# EAGLE design cpx-synth1-pcb (EAGLE 8.6.3)
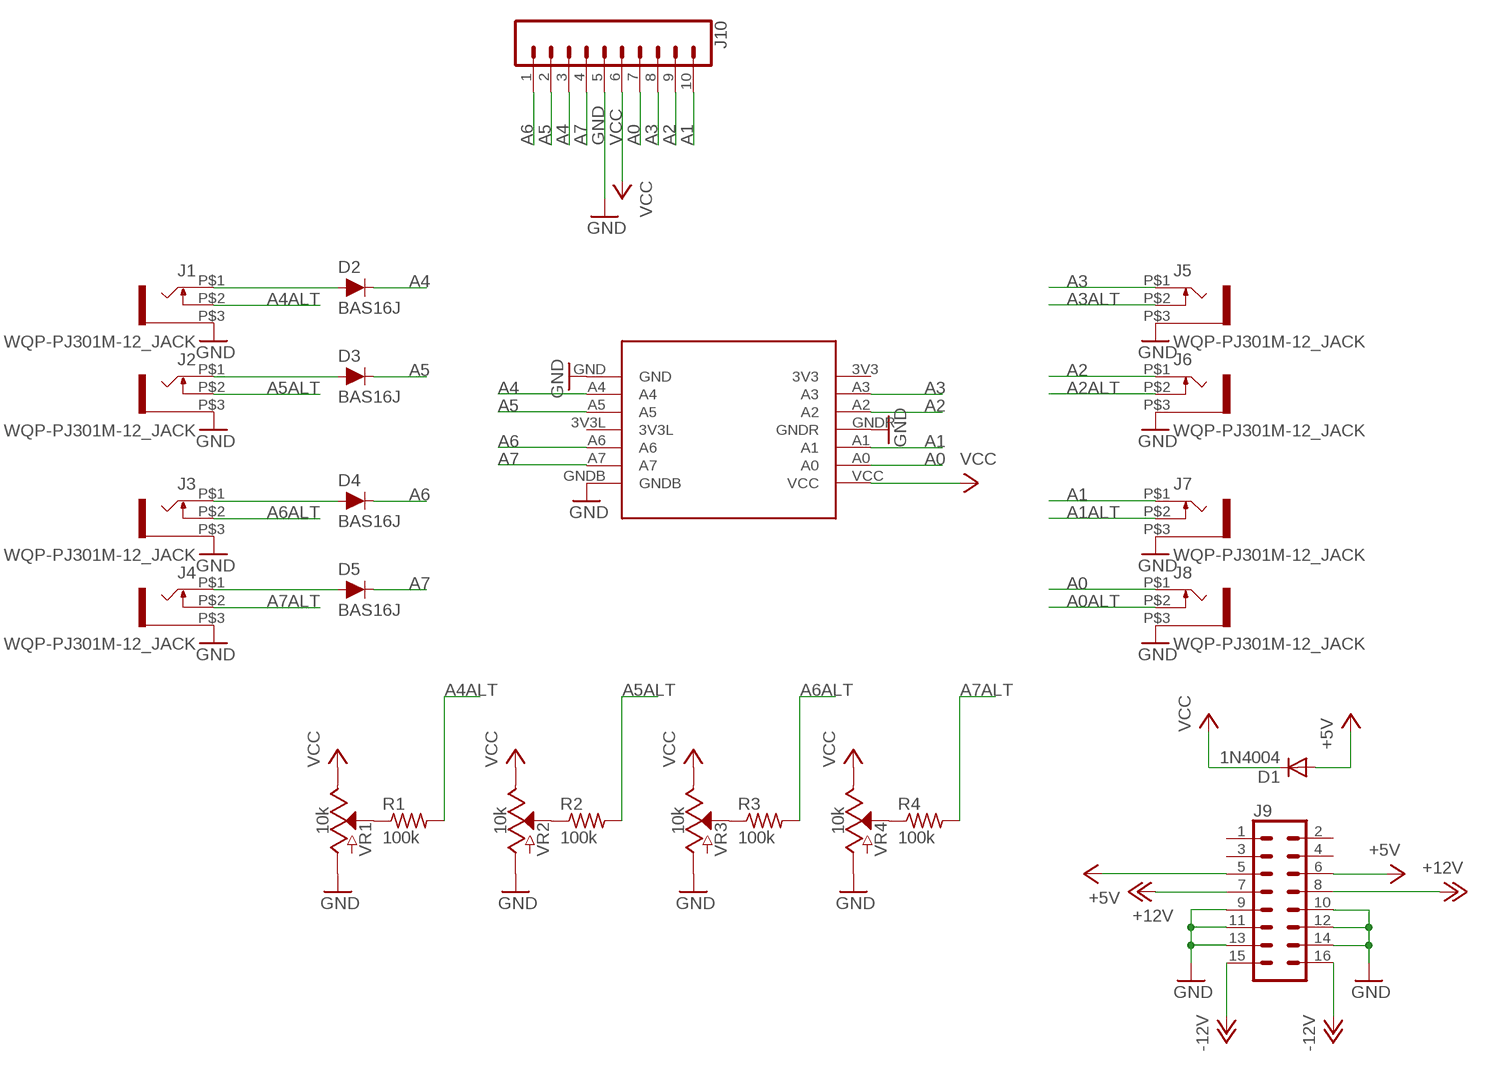
[diagram p0: schematic, sheet 1]

## Parts
D1  1N4004  [DO41-10]
D2  BAS16J  DIODE-BAS16J  [SOD-323]
D3  BAS16J  DIODE-BAS16J  [SOD-323]
D4  BAS16J  DIODE-BAS16J  [SOD-323]
D5  BAS16J  DIODE-BAS16J  [SOD-323]
J1  WQP-PJ301M-12_JACK  [WQP-PJ301M-12_JACK]
J2  WQP-PJ301M-12_JACK  [WQP-PJ301M-12_JACK]
J3  WQP-PJ301M-12_JACK  [WQP-PJ301M-12_JACK]
J4  WQP-PJ301M-12_JACK  [WQP-PJ301M-12_JACK]
J5  WQP-PJ301M-12_JACK  [WQP-PJ301M-12_JACK]
J6  WQP-PJ301M-12_JACK  [WQP-PJ301M-12_JACK]
J7  WQP-PJ301M-12_JACK  [WQP-PJ301M-12_JACK]
J8  WQP-PJ301M-12_JACK  [WQP-PJ301M-12_JACK]
J9  CONN_08X2  [2X8]
J10  CONN_10"  [1X10]
R1  100k  R-US_R0603  [R0603]
R2  100k  R-US_R0603  [R0603]
R3  100k  R-US_R0603  [R0603]
R4  100k  R-US_R0603  [R0603]
U1  CIRCUITPLAYGROUNDEXPRESS  [CIRCUITPLAYGROUNDEXPRESS]
VR1  10k  POTENTIOMETER-PTH-9MM-1/20W-20%-KIT  [POT-PTH-ALPS-KIT]
VR2  10k  POTENTIOMETER-PTH-9MM-1/20W-20%-KIT  [POT-PTH-ALPS-KIT]
VR3  10k  POTENTIOMETER-PTH-9MM-1/20W-20%-KIT  [POT-PTH-ALPS-KIT]
VR4  10k  POTENTIOMETER-PTH-9MM-1/20W-20%-KIT  [POT-PTH-ALPS-KIT]

## Nets
+5V: D1.A J9.5 J9.6
+12V: J9.7 J9.8
-12V: J9.15 J9.16
A0: J8.P$1 J10.7 U1.A0
A0ALT: J8.P$2
A1: J7.P$1 J10.10 U1.A1
A1ALT: J7.P$2
A2: J6.P$1 J10.9 U1.A2
A2ALT: J6.P$2
A3: J5.P$1 J10.8 U1.A3
A3ALT: J5.P$2
A4: D2.C J10.3 U1.A4
A4ALT: J1.P$2 R1.2
A5: D3.C J10.2 U1.A5
A5ALT: J2.P$2 R2.2
A6: D4.C J10.1 U1.A6
A6ALT: J3.P$2 R3.2
A7: D5.C J10.4 U1.A7
A7ALT: J4.P$2 R4.2
GND: J1.P$3 J2.P$3 J3.P$3 J4.P$3 J5.P$3 J6.P$3 J7.P$3 J8.P$3 J9.9 J9.10 J9.11 J9.12 J9.13 J9.14 J10.5 U1.GND U1.GNDB U1.GNDR VR1.P$3(A) VR2.P$3(A) VR3.P$3(A) VR4.P$3(A)
N$1: R1.1 VR1.P$2(S)
N$2: R2.1 VR2.P$2(S)
N$3: R3.1 VR3.P$2(S)
N$4: R4.1 VR4.P$2(S)
N$5: D2.A J1.P$1
N$6: D3.A J2.P$1
N$8: D4.A J3.P$1
N$9: D5.A J4.P$1
VCC: D1.C J10.6 U1.VCC VR1.P$1(E) VR2.P$1(E) VR3.P$1(E) VR4.P$1(E)
Unconnected: J9.1 J9.2 J9.3 J9.4 U1.3V3 U1.3V3L

## Library data of the parts
D1 = adafruit:1N4004: DIODE General purpose 1N400x type rectifier (With bigger pads) http://www.ladyada.net/library/pcb/eaglelibrary.html
D2-D5 = SparkFun-DiscreteSemi:DIODE: Diode These are standard reverse protection diodes and small signal diodes. SparkFun Products: SparkFun SparkPunk Sound Kit <https://www.sparkfun.com/products/11177> SparkFun ESP8266 Thing <https://www.sparkfun.com/products/13231>; PROD_ID: DIO-09646; VALUE: 250mA/100V
J1-J8 = thonkiconn:WQP-PJ301M-12_JACK
J9 = SparkFun-Connectors:CONN_08X2: Multi connection point. Often used as Generic Header-pin footprint for 0.1 inch spaced/style header connections You can populate with any combo of single row headers, but if you'd like an exact match, check this: Header - 2x8 (Male, 0.1") <https://www.sparkfun.com/products/13156> (PRT-13156) On any of the 0.1 inch spaced packages, you can populate with these: Break Away Headers - Straight <https://www.sparkfun.com/products/116> (PRT-00116) Break Away Male Headers - Right Angle <https://www.sparkfun.com/products/553> (PRT-00553) Female Headers <https://www.sparkfun.com/products/115> (PRT-00115) Break Away Headers - Machine Pin <https://www.sparkfun.com/products/117> (PRT-00117) Break Away Female Headers - Swiss Machine Pin <https://www.sparkfun.com/products/743> (PRT-00743)
J10 = SparkFun-Connectors:CONN_10: Multi connection point. Often used as Generic Header-pin footprint for 0.1 inch spaced/style header connections On any of the 0.1 inch spaced packages, you can populate with these: Break Away Headers - Straight <https://www.sparkfun.com/products/116> (PRT-00116) Break Away Male Headers - Right Angle <https://www.sparkfun.com/products/553> (PRT-00553) Female Headers <https://www.sparkfun.com/products/115> (PRT-00115) Break Away Headers - Machine Pin <https://www.sparkfun.com/products/117> (PRT-00117) Break Away Female Headers - Swiss Machine Pin <https://www.sparkfun.com/products/743> (PRT-00743) Arduino Stackable Header - 10 Pin <https://www.sparkfun.com/products/11376> (PRT-11376) For SCREWTERMINALS and SPRING TERMINALS visit here: Screw Terimnals on SparkFun.com <https://www.sparkfun.com/search/results?term=Screw+Terminals> (5mm/3.5mm/2.54mm spacing) This device is also useful as a general connection point to wire up your design to another part of your project. Our various solder wires solder well into these plated through hole pads. Hook-Up Wire - Assortment (Stranded, 22 AWG) <https://www.sparkfun.com/products/11375> (PRT-11375) Hook-Up Wire - Assortment (Solid Core, 22 AWG) <https://www.sparkfun.com/products/11367> (PRT-11367) View the entire wire category on our website here <https://www.sparkfun.com/categories/141> Special notes: Molex polarized connector foot print use with SKU : PRT-08231 with associated crimp pins and housings. 1MM SMD Version SKU: PRT-10208 NOTES ON THE VARIANTS LOCK and LOCK_LONGPADS... This footprint was designed to help hold the alignment of a through-hole component (i.e. 6-pin header) while soldering it into place. You may notice that each hole has been shifted either up or down by 0.005 of an inch from it's more standard position (which is a perfectly straight line). This slight alteration caused the pins (the squares in the middle) to touch the edges of the holes. Because they are alternating, it causes a "brace" to hold the component in place. 0.005 has proven to be the perfect amount of "off-center" position when using our standard breakaway headers. Although looks a little odd when you look at the bare footprint, once you have a header in there, the alteration is very hard to notice. Also,if you push a header all the way into place, it is covered up entirely on the bottom side.; PROD_ID: CONN-11563
R1-R4 = adafruit:R-US_: RESISTOR, American symbol
U1 = todstuff:CIRCUITPLAYGROUNDEXPRESS
VR1-VR4 = SparkFun-Resistors:POTENTIOMETER: Potentiometer (Pot) Three-terminal potentiometers, with an adjustable wiper and two adjustable resistors. A pot can be used to create a configurable voltage divider, or as a variable resistor. Variants ALPS_POT and ALPS_POT_KIT - PTH, breadboard compatible, 9mm square pots Rotary Potentiometer - Linear (10k ohm) <https://www.sparkfun.com/products/9288> (COM-09288) The KIT variant exposes copper on only one side of the PTH pad, so the part can only be assembled on one side of the PCB. Useful for beginner soldering kits.; PROD_ID: RES-09177; SF_SKU: COM-09288

## Board
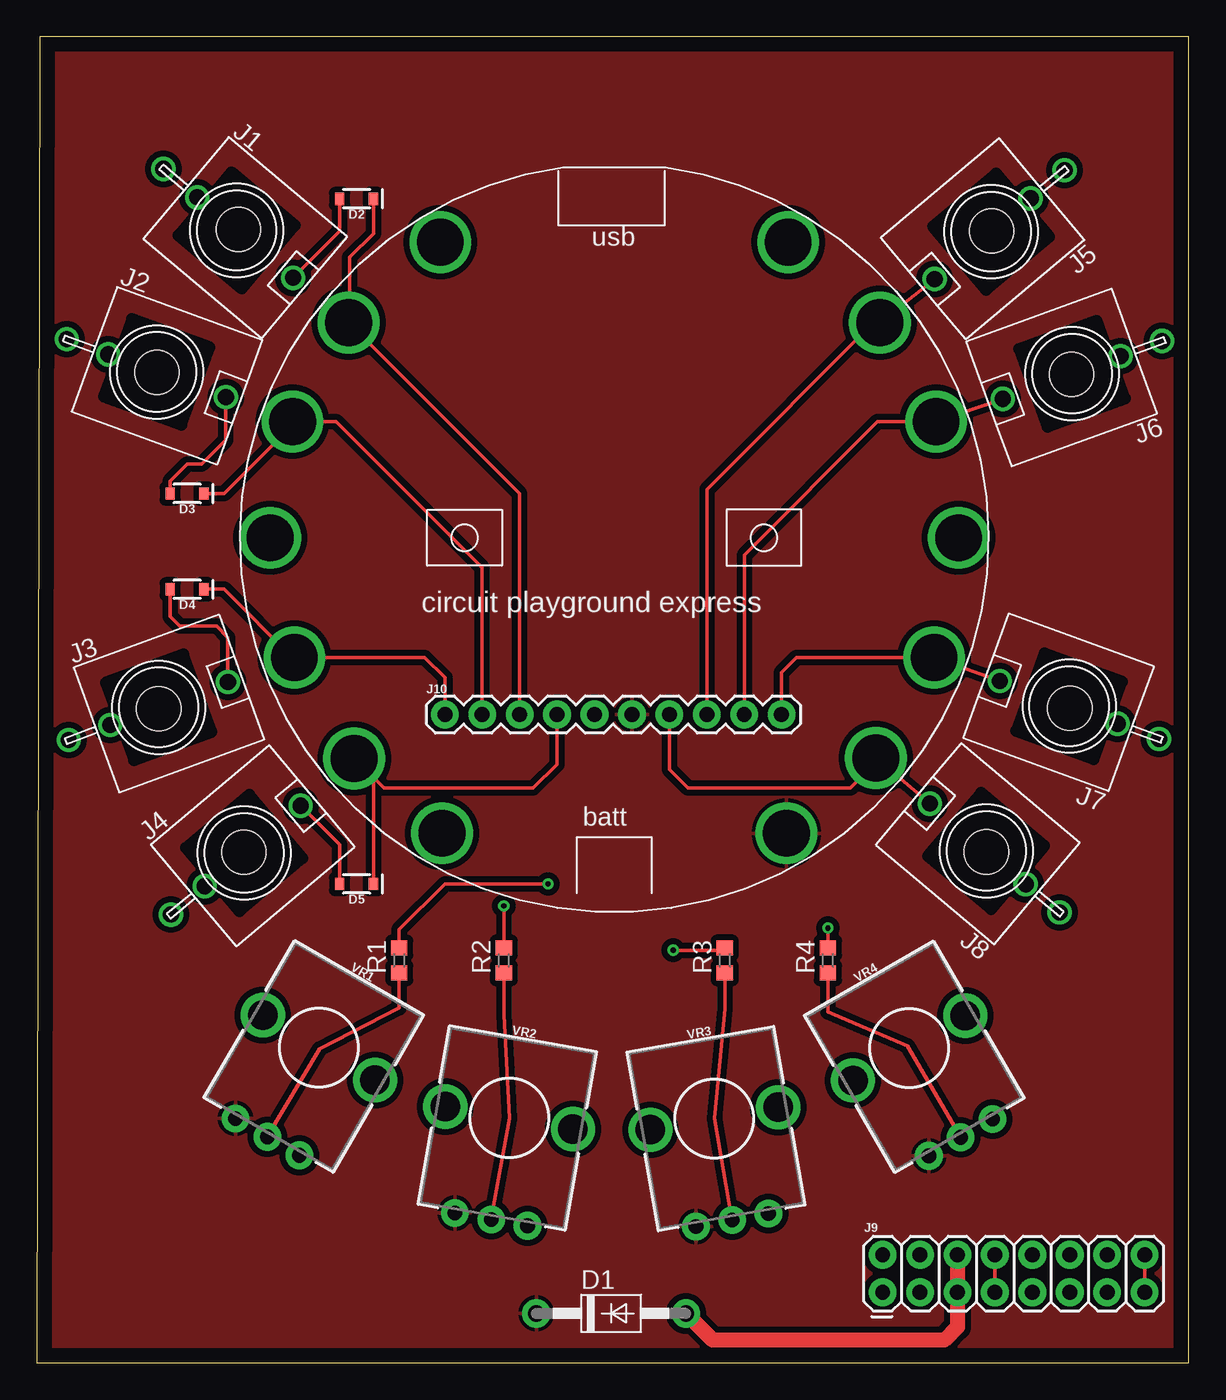
[diagram p1: board, top side]
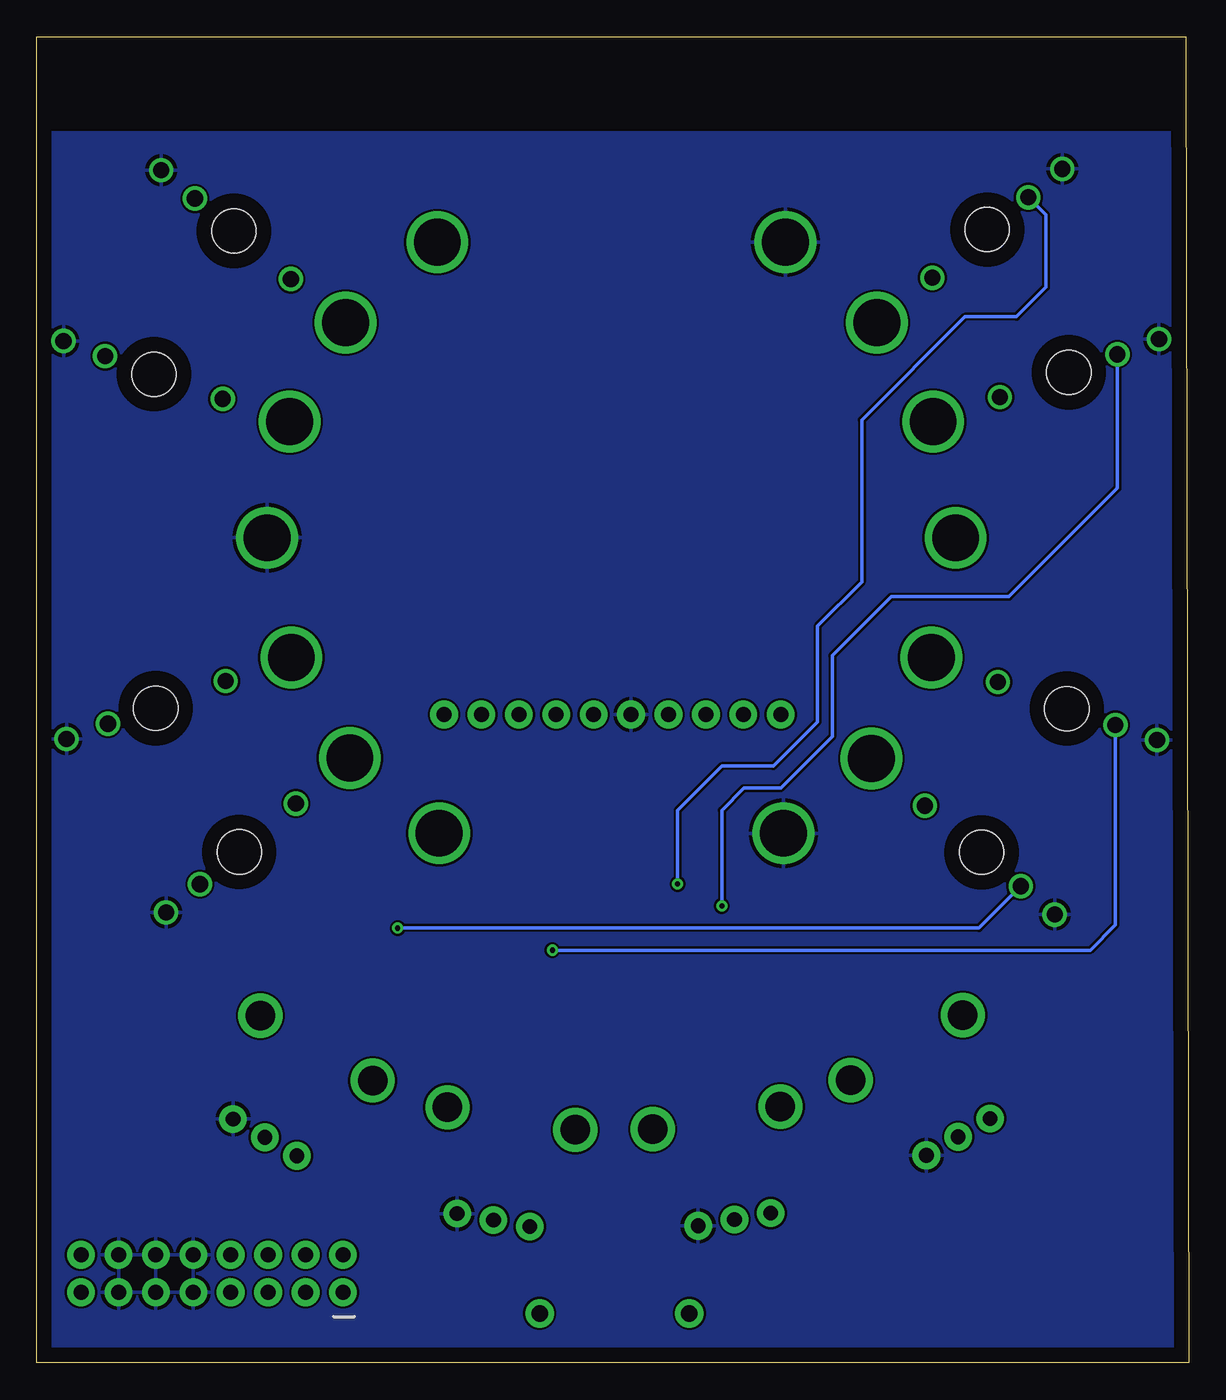
[diagram p2: board, bottom side, seen from below]

Size 78.2 x 90 mm. Coordinates in mm from the lower left corner, seen from the top.
Outline: 0,0 78.2,0 78.2,90 0.2,90 0,0
Copper layers (1*16): Top 0.035mm / dielectric 1.5mm / Bottom 0.035mm
Design rules "default": minimum track width 6mil, minimum drill 0.35mm, track to track 6mil, track to pad 6mil, pad to pad 6mil, via to via 6mil, smd to smd 6mil, copper to edge 40mil, drill to drill 6mil, minimum pad ring 10mil, minimum via ring 8mil, stop-mask expansion 4mil, vias tented up to drill 0mil, thermal gap 10mil
Holes 3 mm at 13.68,76.92 8.15,67.22 8.27,44.4 14.06,34.64 64.46,34.66 70.13,44.42 70.25,67.09 64.82,76.82

### Footprints (pad centres in the part's own frame; a part is rotated, then mirrored left to right if it is on the bottom)
DO41-10 = drill 1.118 pad 1.93: A 5.08,0; C -5.08,0
SOD-323 = smd 0.63 x 0.83: A 1.15,0; C -1.15,0
WQP-PJ301M-12_JACK = drill 1.1: P$1 0,5; P$2 0,-3.5; P$3 0,-6.5
2X8 = drill 1.016 pad 1.88: 1 0,0; 2 0,2.54; 3 2.54,0; 4 2.54,2.54; 5 5.08,0; 6 5.08,2.54; 7 7.62,0; 8 7.62,2.54; 9 10.16,0; 10 10.16,2.54; 11 12.7,0; 12 12.7,2.54; 13 15.24,0; 14 15.24,2.54; 15 17.78,0; 16 17.78,2.54
1X10 = drill 1.016 pad 1.88: 1 0,0; 2 2.54,0; 3 5.08,0; 4 7.62,0; 5 10.16,0; 6 12.7,0; 7 15.24,0; 8 17.78,0; 9 20.32,0; 10 22.86,0
R0603 = smd 1 x 1.1: 1 -0.85,0; 2 0.85,0
CIRCUITPLAYGROUNDEXPRESS = drill 3.175: 3V3 11.811,20.066; 3V3L -23.368,0; A0 17.755,-14.961; A1 21.717,-8.128; A2 21.844,7.874; A3 18.034,14.605; A4 -18.034,14.605; A5 -21.844,7.874; A6 -21.717,-8.128; A7 -17.653,-14.986; GND -11.811,20.066; GNDB -11.684,-20.066; GNDR 23.368,0; VCC 11.684,-20.066
POT-PTH-ALPS-KIT = drill 1 pad 1.88: P$1 7,-2.5; P$2 7,0; P$3 7,2.5 | drill 2: P$4 0,-4.4; P$5 0,4.4

### Placement (x,y rotation side)
D1  38.99,3.35 0 top
D2  21.7,79 180 top
D3  10.2,59 180 top
D4  10.2,52.5 180 top
D5  21.7,32.5 180 top
J1  13.57,76.86 230 top
J2  8.13,67.25 250 top
J3  8.27,44.49 290 top
J4  14.08,34.6 310 top
J5  64.78,76.77 130 top
J6  70.28,67.13 110 top
J7  70.08,44.56 70 top
J8  64.45,34.74 50 top
J9  57.42,4.78 0 top
J10  27.7,44 0 top
R1  24.6,27.3 90 top
R2  31.7,27.3 90 top
R3  46.7,27.3 90 top
R4  53.7,27.3 90 top
U1  39.2,56 0 top
VR1  19.15,21.39 240 top
VR2  32.06,16.62 260 top
VR3  45.99,16.57 280 top
VR4  59.21,21.35 300 top

### Tracks (layer width: path | path; a pad name or v marks a point on that pad's centre or on a via)
+5V
  Top 1.016: D1.A 45.89,1.52 61.6,1.52 62.5,2.42 J9.5 J9.6
+12V
  Top 0.254: J9.8 J9.7
-12V
  Top 0.254: J9.16 J9.15
A0
  Top 0.254: J8.P$1 57.12,40.9 | 57.12,40.9 U1.A0 | J10.7 42.94,40.26 44.2,39 55.22,39 57.12,40.9
A1
  Top 0.254: J7.P$1 U1.A1 56.7,47.87 56.43,47.87 51.57,47.87 50.56,46.86 J10.10
A2
  Top 0.254: J6.P$1 U1.A2 57.07,63.87 48.02,54.82 J10.9
A3
  Top 0.254: U1.A3 57.47,70.79 | 57.47,70.79 J5.P$1 | J10.8 45.48,59.28 56.99,70.79 57.47,70.79
A4
  Top 0.254: U1.A4 21.24,70.54 | 21.24,70.54 32.78,58.99 J10.3 | D2.C 22.85,76.65 21.24,75.03 21.24,70.54
A4ALT  (via drill 0.35)
  Top 0.254: R1.2 24.6,29.4 27.7,32.5 v34.7,32.5
  Bottom 0.254: J1.P$2 9.7,77.92 9.7,73 11.7,71 15.2,71 22.2,64 22.2,53 25.2,50 25.2,43.5 28.2,40.5 31.7,40.5 34.7,37.5 v34.7,32.5
A5
  Top 0.254: J10.2 30.24,53.96 20.33,63.87 U1.A5 17.36,63.66 12.7,59 D3.C
A5ALT  (via drill 0.35)
  Top 0.254: v31.7,31 R2.2
  Bottom 0.254: J2.P$2 4.84,59.36 12.2,52 20.2,52 24.2,48 24.2,42.5 27.7,39 30.2,39 31.7,37.5 v31.7,31
A6
  Top 0.254: 17.28,47.8 U1.A6 | J10.1 27.7,46.5 26.33,47.87 17.7,47.87 U1.A6 | D4.C 12.7,52.5 17.33,47.87 U1.A6
A6ALT  (via drill 0.35)
  Top 0.254: v43.2,28 46.7,28 R3.2
  Bottom 0.254: J3.P$2 4.98,29.72 6.7,28 v43.2,28
A7
  Top 0.254: J10.4 35.32,40.62 33.7,39 23.56,39 U1.A7 22.85,39.71 D5.C
A7ALT  (via drill 0.35)
  Top 0.254: v53.7,29.5 R4.2
  Bottom 0.254: J4.P$2 14.25,29.5 v53.7,29.5
GND
  pour Bottom: -1.8,83.5 80.2,83.5 80.2,-1.3 -1.8,-1.3
N$1
  Top 0.254: R1.1 24.6,24.1 19.2,21.3 VR1.P$2
N$2
  Top 0.254: R2.1 31.7,23.6 32.1,16.6 VR2.P$2
N$3
  Top 0.254: R3.1 46.7,24 46,16.6 VR3.P$2
N$4
  Top 0.254: R4.1 53.7,23.8 59.1,21.5 VR4.P$2
N$5
  Top 0.254: J1.P$1 20.55,76.79 D2.A
N$6
  Top 0.254: J2.P$1 12.83,62.63 11.2,61 10.2,61 9.05,59.85 D3.A
N$8
  Top 0.254: D4.A 9.05,50.65 9.7,50 12.2,50 12.97,49.23 J3.P$1
N$9
  Top 0.254: J4.P$1 20.55,35.17 D5.A
VCC
  pour Top (isolate 0.406): 0.2,102 arc63 78.26,100.36 78.76,-2.06 -0.76,-0.56